# Altium schematic sheet [1] - Schematic Blocks.SchDoc: Interconnections map
size A4; Date: 2025-08-28; ApprovedBy: M Pourmand; CheckedBy: M Pourmand; Author: M Pourmand; CompanyName: Freelance; DrawnBy: M Pourmand; Engineer: M Pourmand; Organization: Freelance; Address1: Paradisgränd 03; Address2: Umedalen; Address3: Umeå; Address4: Sweden; DocumentNumber: 0101020251118001; SheetNumber: 1; SheetTotal: 11; ItemRevision: 1; Time: 17:40
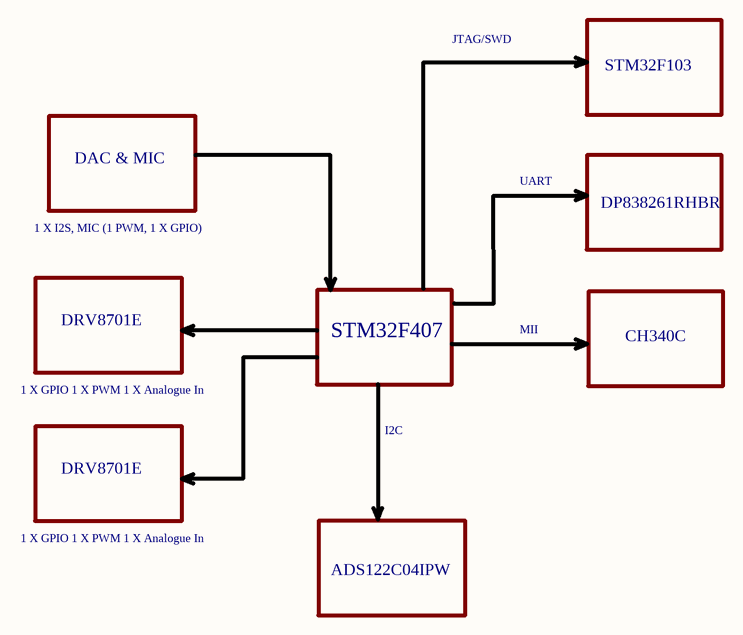
[diagram p0: [1] - Schematic Blocks.SchDoc]

## Notes on the sheet
- JTAG/SWD
- STM32F103
- DAC & MIC
- UART
- DP838261RHBR
- 1 X I2S, MIC (1 PWM, 1 X GPIO)
- DRV8701E
- STM32F407
- MII
- CH340C
- 1 X GPIO 1 X PWM 1 X Analogue In
- I2C
- ADS122C04IPW
- ENG:
- APPROVALS
- DATE
- PROJECT
- DSN:
- CHK:
- REFERENCE DOCUMENTS
- PROJECT REVISION:
- TITLE
- DOCUMENT REVISION:
- DESIGN ITEM:
- BOM:
- FAB DWG:
- PCB DWG:
- ASSY DWG:
- FILE NAME
- A4
- SIZE
- DWG NO.
- SHEET
- OF
- REV